# Altium schematic sheet SK-Connector.SchDoc
size A3; SheetNumber: 2; SheetTotal: 4
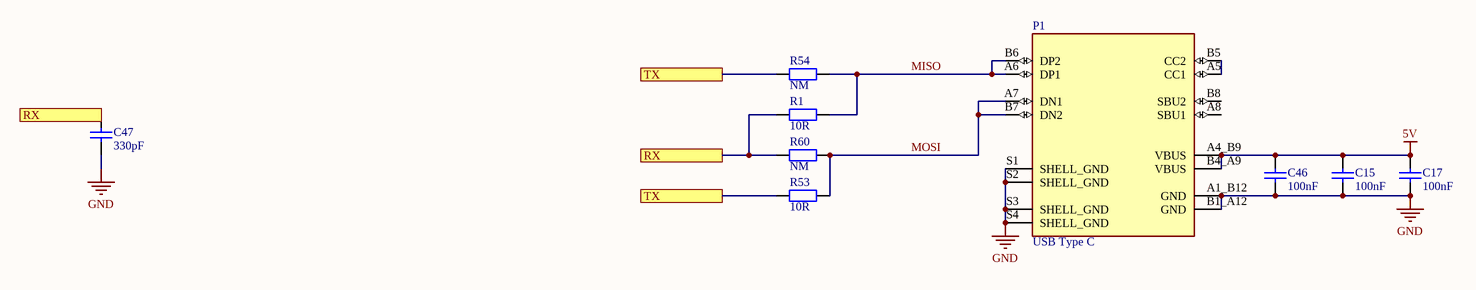
[diagram p0: SK-Connector.SchDoc]

## Parts
C15  100nF  [SMH_RES0805-STD]
C17  100nF  [SMH_RES0805-STD]
C46  100nF  [SMH_RES0805-STD]
C47  330pF  [SMH_RES0805-STD]
P1  USB Type C  [SMH_USB_C]
R1  10R  [SMH_RES0805-STD]
R53  10R  [SMH_RES0805-STD]
R54  NM  [SMH_RES0805-STD]
R60  NM  [SMH_RES0805-STD]

## Ports
RX, TX

## Nets
5V: C15.1 C17.1 C46.1 P1.A4_B9(VBUS) P1.B4_A9(VBUS)
GND: C15.2 C17.2 C46.2 C47.2 P1.A1_B12(GND) P1.B1_A12(GND) P1.S1(SHELL_GND) P1.S2(SHELL_GND) P1.S3(SHELL_GND) P1.S4(SHELL_GND)
MISO: P1.A6(DP1) P1.B6(DP2) R1.1 R54.2
MOSI: P1.A7(DN1) P1.B7(DN2) R53.2 R60.1
RX: C47.1 R1.2 R60.2 ; port RX
TX: R53.1 R54.1 ; port TX
NetP1_A5: P1.A5(CC1) P1.B5(CC2)

Not connected (* = marked no-connect by the designer): P1 A8(SBU1) B8(SBU2)

## Library data of the parts
C15 C17 C46 C47 = Cap: Capacitor; Published: 8-Jun-2000; LatestRevisionDate: 17-Jul-2002; LatestRevisionNote: Re-released for DXP Platform.; PackageReference: RAD-0.3; Publisher: Altium Limited
  C15 C17 C46: Value: 100nF
  C47: Value: 330pF
R1 R53 R54 R60 = Res2: Resistor; Published: 8-Jun-2000; LatestRevisionDate: 17-Jul-2002; LatestRevisionNote: Re-released for DXP Platform.; PackageReference: AXIAL-0.4; Publisher: Altium Limited; PackageDescription: Axial Device, Thru-Hole; 2 Leads; 0.4 in Pin Spacing
  R1 R53: Value: 10R
  R54 R60: Value: NM
P1 = USB Type C: Value: USB Type C